# Altium project MB1455.PrjPcb
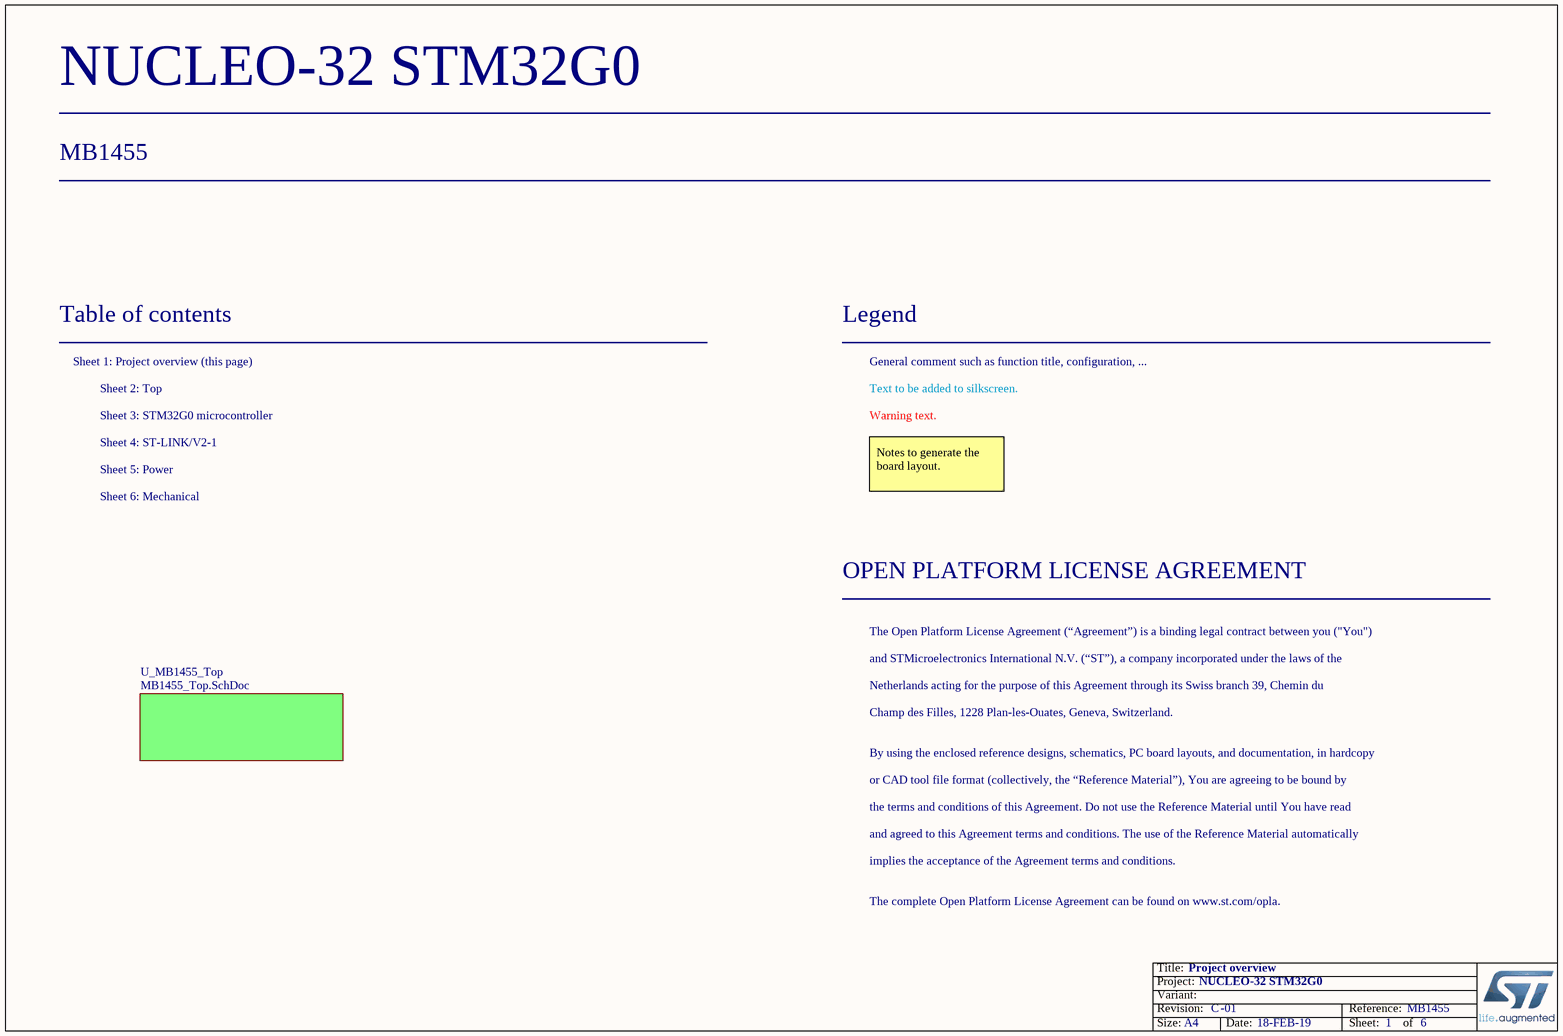
[diagram p0: Project_overview.SchDoc]
Board_Assembly_Revision: 01; Board_Document_Date: 18-FEB-19; Board_Name: NUCLEO-32 STM32G0; Board_PCB_Revision: C; Board_Reference: MB1455
6 sheets, 97 parts. Net scope: flat (ports and power ports of the same name join across sheets).
Board file: MB1455.PcbDoc
Sheets:
  Project_overview.SchDoc
    U_MB1455_Top = MB1455_Top.SchDoc
      U_Power = Power.SchDoc
      Mechanical = Mechanical.SchDoc
      U_ST_LINK_V2-1 = ST_LINK_V2-1.SCHDOC
      U_STM32G0_microcontroller = STM32G0_microcontroller.SchDoc

## Sheet Project_overview.SchDoc: Project overview
size A4; Date: Not used; ApprovedBy: Not used; CheckedBy: Not used; Author: Not used; CompanyName: STMicroelectronics; DrawnBy: Not used; Engineer: Not used; Organization: Not used; Address1: Not used; Address2: Not used; Address3: Not used; Address4: Not used; DocumentNumber: Not used; Revision: Not used; SheetNumber: 1; SheetTotal: 6; CurrentTime: Not used; CurrentDate: Not used; Time: Not used; DocumentFullPathAndName: Not used; DocumentName: Not used; ModifiedDate: Not used; ImagePath: Not used; ProjectName: Not used; Application_BuildNumber: Not used

### Sub-sheets
U_MB1455_Top = MB1455_Top.SchDoc: no entries

### Notes on the sheet
- Table of contents
- Sheet 1: Project overview (this page)
- Legend
- General comment such as function title, configuration, ...
- Sheet 2: Top
- Sheet 4: ST-LINK/V2-1
- Sheet 3: STM32G0 microcontroller
- Text to be added to silkscreen.
- Warning text.
- Sheet 5: Power
- Sheet 6: Mechanical
- Notes to generate the board layout.
- OPEN PLATFORM LICENSE AGREEMENT
- The Open Platform License Agreement (“Agreement”) is a binding legal contract between you ("You")
- and STMicroelectronics International N.V. (“ST”), a company incorporated under the laws of the
- Netherlands acting for the purpose of this Agreement through its Swiss branch 39, Chemin du
- Champ des Filles, 1228 Plan-les-Ouates, Geneva, Switzerland.
- By using the enclosed reference designs, schematics, PC board layouts, and documentation, in hardcopy
- or CAD tool file format (collectively, the “Reference Material”), You are agreeing to be bound by
- the terms and conditions of this Agreement. Do not use the Reference Material until You have read
- and agreed to this Agreement terms and conditions. The use of the Reference Material automatically
- implies the acceptance of the Agreement terms and conditions.
- The complete Open Platform License Agreement can be found on www.st.com/opla.
- Title:
- Project:
- Size:
- Revision:
- Variant:
- A4
- -
- Date:
- Reference:
- Sheet:
- of

## Sheet MB1455_Top.SchDoc: Top hierarchical view
size A4; Date: Not used; ApprovedBy: Not used; CheckedBy: Not used; Author: Not used; CompanyName: STMicroelectronics; DrawnBy: Not used; Engineer: Not used; Organization: Not used; Address1: Not used; Address2: Not used; Address3: Not used; Address4: Not used; DocumentNumber: Not used; Revision: A-01-P3; SheetNumber: 2; SheetTotal: 6; CurrentTime: Not used; CurrentDate: Not used; Time: Not used; DocumentFullPathAndName: Not used; DocumentName: Not used; ModifiedDate: Not used; ImagePath: Not used; ProjectName: Not used; Application_BuildNumber: Not used
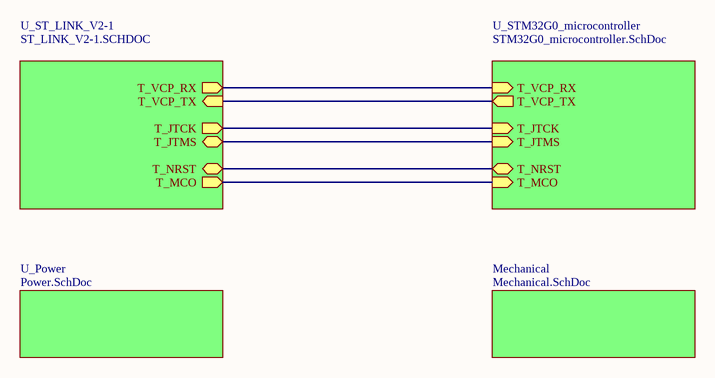
[diagram p1: MB1455_Top.SchDoc]

### Sub-sheets
Mechanical = Mechanical.SchDoc: no entries
U_Power = Power.SchDoc: no entries
U_ST_LINK_V2-1 = ST_LINK_V2-1.SCHDOC: T_VCP_RX (out), T_VCP_TX (in), T_JTMS (bidir), T_JTCK (out), T_NRST (bidir), T_MCO (out)
U_STM32G0_microcontroller = STM32G0_microcontroller.SchDoc: T_NRST (bidir), T_JTCK (in), T_JTMS (in), T_VCP_RX (in), T_VCP_TX (out), T_MCO (in)

### Nets
(unnamed): sheet U_ST_LINK_V2-1/T_VCP_RX, sheet U_STM32G0_microcontroller/T_VCP_RX
(unnamed): sheet U_ST_LINK_V2-1/T_VCP_TX, sheet U_STM32G0_microcontroller/T_VCP_TX
(unnamed): sheet U_ST_LINK_V2-1/T_JTMS, sheet U_STM32G0_microcontroller/T_JTMS
(unnamed): sheet U_ST_LINK_V2-1/T_JTCK, sheet U_STM32G0_microcontroller/T_JTCK
(unnamed): sheet U_ST_LINK_V2-1/T_NRST, sheet U_STM32G0_microcontroller/T_NRST
(unnamed): sheet U_ST_LINK_V2-1/T_MCO, sheet U_STM32G0_microcontroller/T_MCO

### Notes on the sheet
- Title:
- Project:
- Size:
- Revision:
- Variant:
- A4
- -
- Date:
- Reference:
- Sheet:
- of

## Sheet Power.SchDoc: Power
size A4; Date: Not used; ApprovedBy: Not used; CheckedBy: Not used; Author: Not used; CompanyName: STMicroelectronics; DrawnBy: Not used; Engineer: Not used; Organization: Not used; Address1: Not used; Address2: Not used; Address3: Not used; Address4: Not used; DocumentNumber: Not used; Revision: Not used; SheetNumber: 5; SheetTotal: 6; CurrentTime: Not used; CurrentDate: Not used; Time: Not used; DocumentFullPathAndName: Not used; DocumentName: Not used; ModifiedDate: Not used; ImagePath: Not used; ProjectName: Not used; Application_BuildNumber: Not used
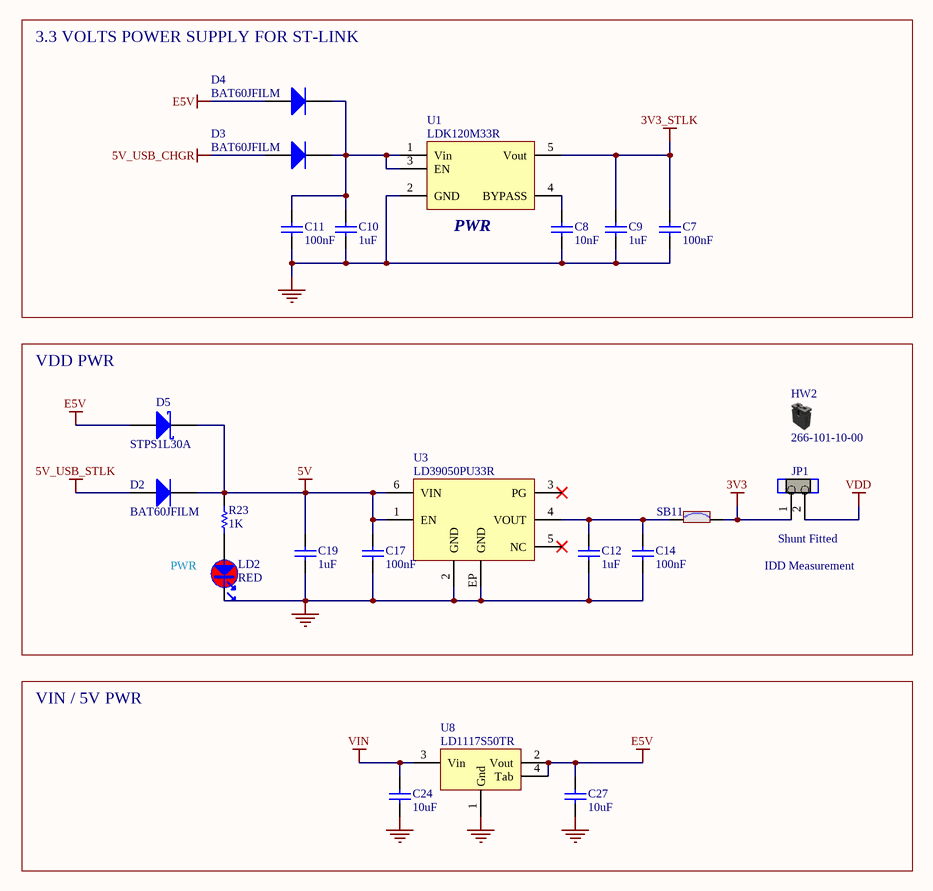
[diagram p2: Power.SchDoc]

### Parts
C7  value 100nF  [C0402]  (hidden comment: Capacitor)
C8  value 10nF  [C0402]  (hidden comment: Capacitor)
C9  value 1uF  [C0402]  (hidden comment: Capacitor)
C10  value 1uF  [C0402]  (hidden comment: Capacitor)
C11  value 100nF  [C0402]  (hidden comment: Capacitor)
C12  value 1uF  [C0402]  (hidden comment: Capacitor)
C14  value 100nF  [C0402]  (hidden comment: Capacitor)
C17  value 100nF  [C0402]  (hidden comment: Capacitor)
C19  value 1uF  [C0402]  (hidden comment: Capacitor)
C24  value 10uF  [C0805]  (hidden comment: Capacitor)
C27  value 10uF  [C0805]  (hidden comment: Capacitor)
D2  BAT60JFILM  [DIO_SOD323]
D3  BAT60JFILM  [DIO_SOD323]
D4  BAT60JFILM  [DIO_SOD323]
D5  value STPS1L30A  [DIO_SMA_1A_2K]  (hidden comment: STPS1L40M)
HW2  value 266-101-10-00  (hidden comment: Shunt Black 1.27mm 266-101-10-00)  (mechanical)
JP1  value Shunt Fitted  [CON_WP_707-2-02-2-20-00]  (hidden comment: Jumper_Header1.27 2x1 Fitted)
LD2  value RED  [LED_0603_RED_H0P4]  (hidden comment: LED_red)
R23  value 1K  [R0402]  (hidden comment: Resistor)
SB11  SB_ON  [SOLDER-BRIDGE_R0603-0R]  (value not drawn)
U1  LDK120M33R  [REG_SOT23-5L]
U3  LD39050PU33R  [ICC_DFN6-EPAD_3X3_P095]
U8  LD1117S50TR  [REG_SOT223-TAB]

### Blocks framed on the sheet
VDD PWR: C12 C14 C17 C19 D2 D5 HW2 JP1 LD2 R23 SB11 U3
VIN / 5V PWR: C24 C27 U8

### Nets
3V3: JP1.1 SB11.2
3V3_STLK: C7.2 C9.2 U1.5(Vout)
5V: C17.2 C19.2 D2.2(K) D5.2(K) R23.2 U3.1(EN) U3.6(VIN)
5V_USB_CHGR: D3.1(A)
5V_USB_STLK: D2.1(A)
E5V: C27.2 D4.1(A) D5.1(A) U8.2(Vout) U8.4(Tab)
GND: C7.1 C8.1 C9.1 C10.1 C11.1 C12.1 C14.1 C17.1 C19.1 C24.1 C27.1 LD2.2 U1.2(GND) U3.2(GND) U3.EP(GND) U8.1(Gnd)
VDD: JP1.2
VIN: C24.2 U8.3(Vin)
NetC8_2: C8.2 U1.4(BYPASS)
NetC10_2: C10.2 C11.2 D3.2(K) D4.2(K) U1.1(Vin) U1.3(EN)
NetC12_2: C12.2 C14.2 SB11.1 U3.4(VOUT)
NetLD2_1: LD2.1 R23.1

Not connected (* = marked no-connect by the designer): U3 3(PG)* 5(NC)*

### Notes on the sheet
- 3.3 VOLTS POWER SUPPLY FOR ST-LINK
- (near U1) PWR
- PWR
- IDD Measurement
- Title:
- Project:
- Size:
- Revision:
- Variant:
- A4
- -
- Date:
- Reference:
- Sheet:
- of

### Library data of the parts
C7 C11 C14 C17 = MCD-00102: Capacitor, MLCC, 100nF, 16V, X7R, 10%, 0402, T=0,5mm; Manufacturer_Part_Number: CC0402KRX7R7BB104; Manufacturer: YAGEO; Alternate_Manufacturer_Part_Number: GCM155R71C104KA55D; Alternate_Manufacturer: MURATA; Provided_By: SUBCO; ECCN_US: EAR99; ECCN_EU: NEC; Internal_Part_Number: MCD-00102; Status: Released; Package: C0402; ComponentLink1Description: Datasheet; Part_Type: Capacitor; ComponentLink1URL: http://tunmcdsvn.tun.st.com/Component_Datasheet_Library/Trunk/Capacitors/Yageo_Multilayer_Capacitor_X7R_series_100pF_to_22uF
C8 = MCD-00011: Capacitor, MLCC, 10nF, 16V, X7R, 10%, 0402, T=0.5mm; Manufacturer_Part_Number: CC0402KRX7R7BB103; Manufacturer: YAGEO; Provided_By: SUBCO; ECCN_US: EAR99; ECCN_EU: NEC; Internal_Part_Number: MCD-00011; Status: Released; Part_Type: Capacitor; Package: C0402; ComponentLink1Description: Datasheet; ComponentLink1URL: http://tunmcdsvn.tun.st.com/Component_Datasheet_Library/Trunk/Capacitors/Yageo_Multilayer_Capacitor_X7R_series_100pF_to_22uF
C9 C10 C12 C19 = MCD-00095: Capacitor, MLCC, 1uF, 6V3, X5R, 10%, 0402, T=0,5mm; Manufacturer_Part_Number: GRM155R61E105KA12; Manufacturer: MURATA; Alternate_Manufacturer_Part_Number: GRM155R60J105KE19; Provided_By: SUBCO; ECCN_US: EAR99; ECCN_EU: NEC; Internal_Part_Number: MCD-00095; Status: Released; Package: C0402; ComponentLink1Description: Datasheet; Part_Type: Capacitor; ComponentLink1URL: http://tunmcdsvn.tun.st.com/Component_Datasheet_Library/Trunk/Capacitors/Murata_Capacitor_GR_series; Alternate_Manufacturer: MURATA
C24 C27 = MCD-00014: Capacitor, MLCC, 10uF, 25V, X5R, 10%, 0805, T=0,85mm; Manufacturer_Part_Number: CC0805KRX5R8BB106; Manufacturer: YAGEO; Provided_By: SUBCO; ECCN_US: EAR99; ECCN_EU: NEC; Internal_Part_Number: MCD-00014; ComponentLink1Description: Datasheet; Status: Released; Part_Type: Capacitor; Package: C0805; ComponentLink1URL: http://tunmcdsvn.tun.st.com/Component_Datasheet_Library/Trunk/Capacitors/Yageo_Multilayer_capacitor_X5R_series_100pF_to_100uF
D2-D4 = MCD-00034: Part_Type: Diode; Manufacturer: STMICROELECTRONICS; BMS_Part_Number: 9151097; ECCN_US: EAR99; ECCN_EU: NEC; Provided_By: SUBCO with ST control; Internal_Part_Number: MCD-00034; Value: BAT60JFILM; Status: Released; Manufacturer_Part_Number: BAT60JFILM; ComponentLink1Description: Datasheet; ComponentLink1URL: http://tunmcdsvn.tun.st.com/Component_Datasheet_Library/Trunk/Diodes/STM_Diode_BAT60JFILM-SOD323
D5 = MCD-01059: LOW DROP POWER SCHOTTKY RECTIFIER 1A 30V VF=0.3V; Part_Type: Diode; Manufacturer: STMICROELECTRONICS; BMS_Part_Number: 9151096; Provided_By: SUBCO with ST control; ECCN_US: EAR99; ECCN_EU: NEC; Internal_Part_Number: MCD-01059; Status: Footprint available; Manufacturer_Part_Number: STPS1L30A; Package: DIO_SMA_1A_2K; ComponentLink1Description: Datasheet; ComponentLink1URL: http://tunmcdsvn.tun.st.com/Component_Datasheet_Library/Trunk/Diodes/STM_SCHOTTKY_STPS1L30
HW2 = MCD-01409: SHUNT 1.27mm BLACK; Part_Type: Mechanical; Manufacturer: W & P Products; Alternate_Manufacturer_Part_Number: M50-1900005; Alternate_Manufacturer: HARWIN; Provided_By: SUBCO; Internal_Part_Number: MCD-01409; Status: Checked; Manufacturer_Part_Number: 266-101-10-00; ComponentLink1Description: Datasheet; ComponentLink1URL: http://tunmcdsvn.tun.st.com/Component_Datasheet_Library/Trunk/Connectors/WPPRO_Shunt_Jumper_266; ECCN_US: n/a; ECCN_EU: n/a
JP1 = MCD-01428: Header, 2x1, 1,27mm, Right Angled, Single Row, Height 3.05mm/1.27mm; Part_Type: Connector; Manufacturer_Part_Number: 707-2-02-2-20-00; Manufacturer: W & P Products; Provided_By: SUBCO; Internal_Part_Number: MCD-01428; Status: Checked; ComponentLink1Description: Datasheet; ComponentLink1URL: http://tunmcdsvn.tun.st.com/Component_Datasheet_Library/Trunk/Connectors/WPPRO_connector_707-series; ECCN_US: n/a; ECCN_EU: n/a
LD2 = MCD-00322: LED, Red, 0603; Manufacturer_Part_Number: 19-217/R6C-AL1M2VY/3T; Manufacturer: EVERLIGHT; Part_Type: Display; Provided_By: SUBCO; ECCN_US: EAR99; ECCN_EU: NEC; Internal_Part_Number: MCD-00322; ComponentLink1Description: Datasheet; Status: Released; ComponentLink1URL: http://tunmcdsvn.tun.st.com/Component_Datasheet_Library/Trunk/Display/Everlight_SMD-LED-RED_19-213-R6C-AP1Q2B-3T-V3.doc; Package: LED 0603
R23 = MCD-00061: Resistor,1K,0402,1%,1/16W; Manufacturer_Part_Number: RC0402FR-071KL; Manufacturer: YAGEO; Provided_By: SUBCO; ECCN_US: EAR99; ECCN_EU: NEC; Internal_Part_Number: MCD-00061; Status: Released; Part_Type: Resistor; Package: R0402; ComponentLink1Description: Datasheet; ComponentLink1URL: http://tunmcdsvn.tun.st.com/Component_Datasheet_Library/Trunk/Resistors/Yageo_Resistor_RC0402-series
SB11 = MCD-00071: Solder Bridge ON; Part_Type: Mechanical; Manufacturer_Part_Number: RC0603JR-070RL; Manufacturer: YAGEO; Provided_By: SUBCO; Internal_Part_Number: MCD-00071; ECCN_US: n/a; ECCN_EU: n/a; Status: Released; Package: SB0603; ComponentLink1Description: Datasheet; ComponentLink1URL: http://tunmcdsvn.tun.st.com/Component_Datasheet_Library/Trunk/Resistors/Yageo_Resistor_RC0603-series
U1 = MCD-00663: 200 mA low quiescent current very low noise LDO; Part_Type: IC; Manufacturer: STMICROELECTRONICS; BMS_Part_Number: 9176330; ECCN_US: EAR99; ECCN_EU: NEC; Provided_By: SUBCO with ST control; Internal_Part_Number: MCD-00663; Value: LDK120M33R; Status: Footprint available; Manufacturer_Part_Number: LDK120M33R; Package: SOT23-5L; ComponentLink1Description: Datasheet; ComponentLink1URL: http://tunmcdsvn.tun.st.com/Component_Datasheet_Library/Trunk/IC/STM_LDO_LDK120M33R
U3 = MCD-00215: Low quiescent current and low noise voltage regulators; Manufacturer: STMICROELECTRONICS; Part_Type: IC; BMS_Part_Number: 9176126; Provided_By: SUBCO with ST control; ECCN_US: EAR99; ECCN_EU: NEC; Value: LD39050PU33R; Internal_Part_Number: MCD-00215; Manufacturer_Part_Number: LD39050PU33R; Status: Released; ComponentLink1Description: Datasheet; ComponentLink1URL: http://tunmcdsvn.tun.st.com/Component_Datasheet_Library/Trunk/IC/STM_LDO_LD39050PU; Package: DFN6 3x3mm
U8 = MCD-00088: IC REG LDO 5V 0.8A SOT223; Manufacturer: STMICROELECTRONICS; BMS_Part_Number: 9176133; Provided_By: SUBCO with ST control; ECCN_US: EAR99; ECCN_EU: NEC; Value: LD1117S50TR; Internal_Part_Number: MCD-00088; Manufacturer_Part_Number: LD1117S50TR; ComponentLink1Description: Datasheet; Status: Released; Part_Type: IC; ComponentLink1URL: http://tunmcdsvn.tun.st.com/Component_Datasheet_Library/Trunk/IC/STM_LDO_LD1117; Package: SOT-223

## Sheet Mechanical.SchDoc: Mechanical
size A4; Date: Not used; ApprovedBy: Not used; CheckedBy: Not used; Author: Not used; CompanyName: STMicroelectronics; DrawnBy: Not used; Engineer: Not used; Organization: Not used; Address1: Not used; Address2: Not used; Address3: Not used; Address4: Not used; DocumentNumber: Not used; Revision: Not used; SheetNumber: 6; SheetTotal: 6; CurrentTime: Not used; CurrentDate: Not used; Time: Not used; DocumentFullPathAndName: Not used; DocumentName: Not used; ModifiedDate: Not used; ImagePath: Not used; ProjectName: Not used; Application_BuildNumber: Not used
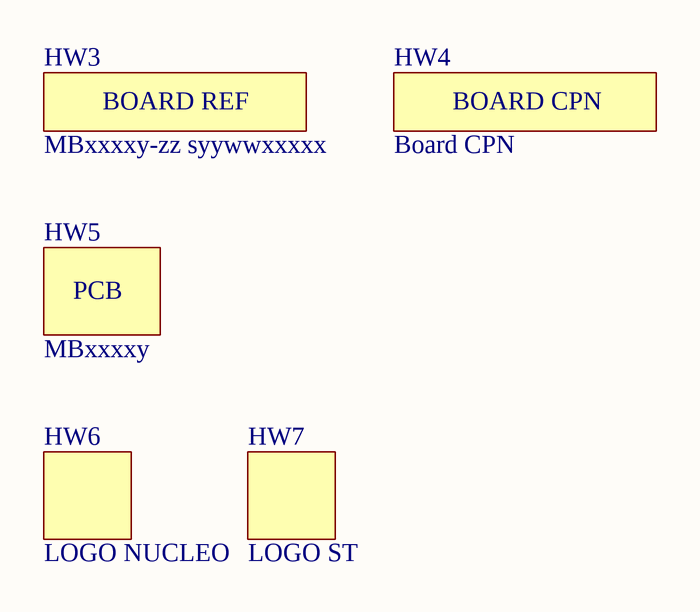
[diagram p3: Mechanical.SchDoc]

### Parts
HW3  value MBxxxxy-zz syywwxxxxx  [STICKER_25X9]  (hidden comment: STICKER_BOARD_REF)  (mechanical)
HW4  value Board CPN  [STICKER_25X9]  (hidden comment: STICKER_BOARD_CPN)  (mechanical)
HW5  value MBxxxxy  (hidden comment: PCB)  (mechanical)
HW6  value LOGO NUCLEO  [LOGO_NUCLEO]  (hidden comment: Logo)  (no BOM)
HW7  value LOGO ST  [LOGO_ST]  (hidden comment: Logo)  (no BOM)

### Notes on the sheet
- Title:
- Project:
- Size:
- Revision:
- Variant:
- A4
- -
- Date:
- Reference:
- Sheet:
- of
- (in symbol MCD-00235) BOARD REF
- (in symbol MCD-00547) BOARD CPN

### Library data of the parts
HW3 = MCD-00235: Sticker to mention board reference + serial number; Part_Type: Mechanical; Provided_By: SUBCO; Internal_Part_Number: MCD-00235; Status: Released; Manufacturer_Part_Number: n/a; Manufacturer: n/a; ComponentLink1Description: Datasheet; ComponentLink1URL: n/a; ECCN_US: n/a; ECCN_EU: n/a
HW4 = MCD-00547: Sticker to mention board CPN code; Part_Type: Mechanical; Provided_By: SUBCO; Internal_Part_Number: MCD-00547; Status: Released; Manufacturer_Part_Number: n/a; Manufacturer: n/a; ComponentLink1Description: Datasheet; ComponentLink1URL: NA; ECCN_US: n/a; ECCN_EU: n/a
HW5 = MCD-00216: PCB, xxxx for PCB number, Y for PCB revision; Part_Type: Mechanical; Provided_By: SUBCO; Internal_Part_Number: MCD-00216; Status: Released; ComponentLink1Description: Datasheet; Manufacturer_Part_Number: n/a; Manufacturer: n/a; ECCN_US: n/a; ECCN_EU: n/a
HW6 = MCD-00636: NUCLEO logo footprint for PCB; Part_Type: Mechanical; Internal_Part_Number: MCD-00636; Status: Released; Provided_By: n/a; ComponentLink1Description: Datasheet; ECCN_US: n/a; ECCN_EU: n/a
HW7 = MCD-00625: STMicroelectronics logo footprint for PCB; Part_Type: Mechanical; Internal_Part_Number: MCD-00625; Status: Released; Provided_By: n/a; Manufacturer_Part_Number: n/a; Manufacturer: n/a; ComponentLink1Description: Datasheet; ComponentLink1URL: http://na; ECCN_US: n/a; ECCN_EU: n/a

## Sheet ST_LINK_V2-1.SCHDOC: ST_LINK_V2-1
size A4; Date: Not used; ApprovedBy: Not used; CheckedBy: Not used; Author: Not used; CompanyName: STMicroelectronics; DrawnBy: Not used; Engineer: Not used; Organization: Not used; Address1: Not used; Address2: Not used; Address3: Not used; Address4: Not used; DocumentNumber: Not used; Revision: Not used; SheetNumber: 4; SheetTotal: 6; CurrentTime: Not used; CurrentDate: Not used; Time: Not used; DocumentFullPathAndName: Not used; DocumentName: Not used; ModifiedDate: Not used; ImagePath: Not used; ProjectName: Not used; Application_BuildNumber: Not used
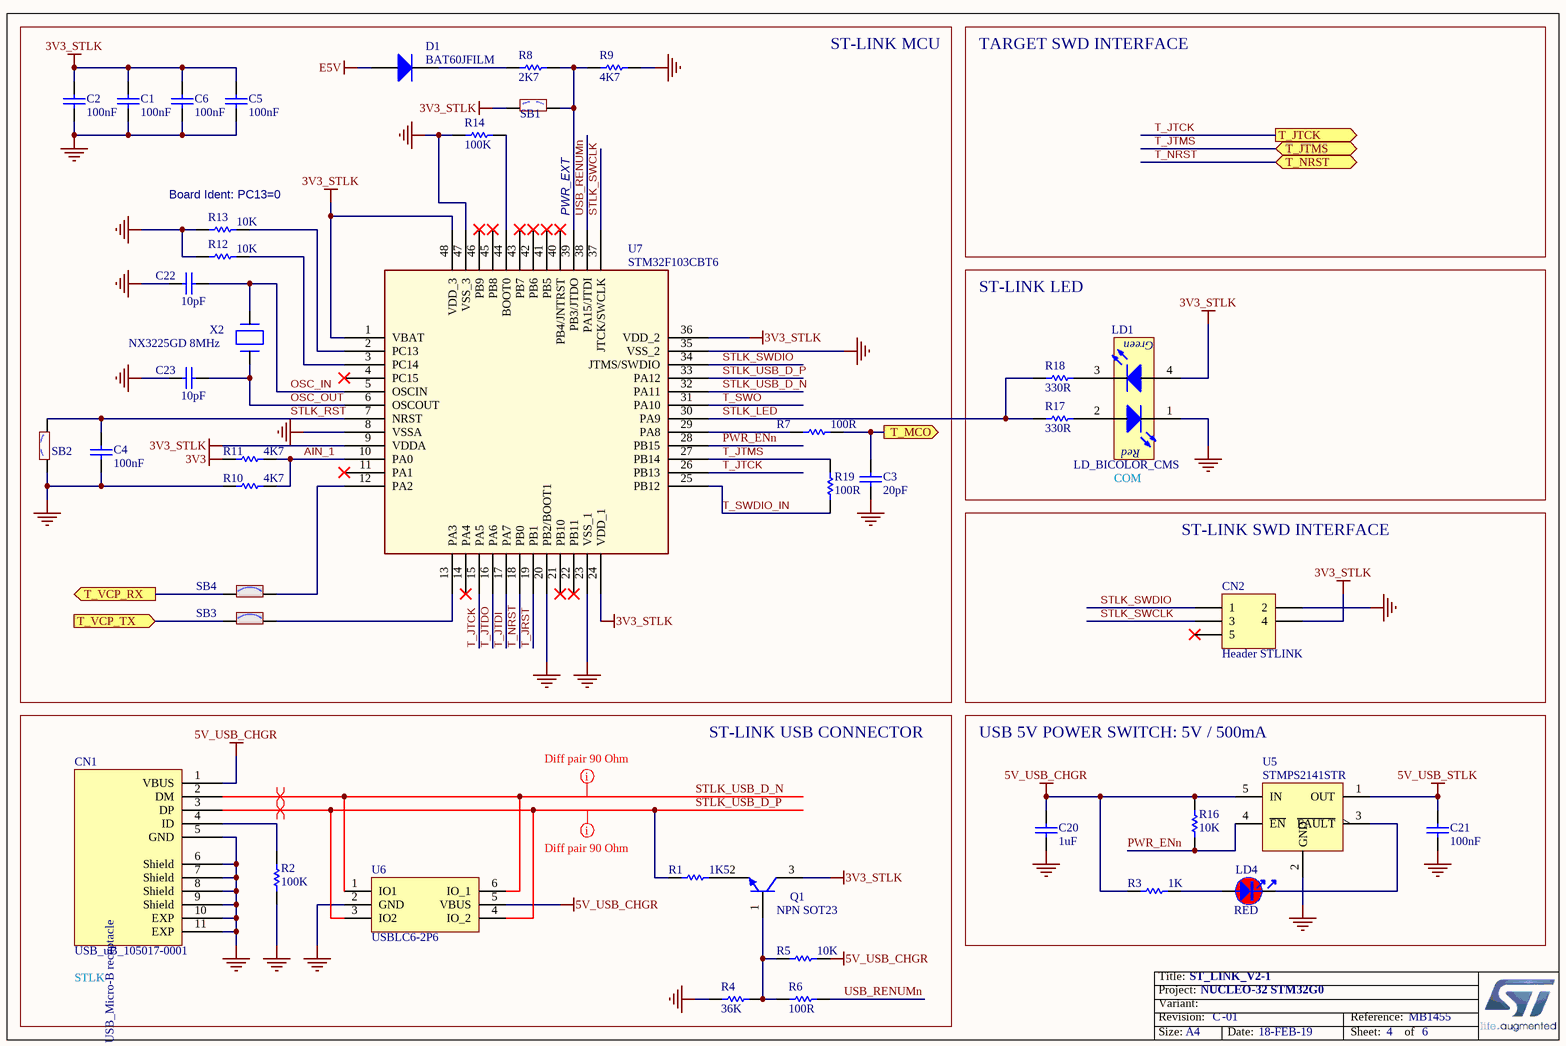
[diagram p4: ST_LINK_V2-1.SCHDOC]

### Parts
C1  value 100nF  [C0402]  (hidden comment: Capacitor)
C2  value 100nF  [C0402]  (hidden comment: Capacitor)
C3  value 20pF  [C0402]  (hidden comment: Capacitor)
C4  value 100nF  [C0402]  (hidden comment: Capacitor)
C5  value 100nF  [C0402]  (hidden comment: Capacitor)
C6  value 100nF  [C0402]  (hidden comment: Capacitor)
C20  value 1uF  [C0402]  (hidden comment: Capacitor)
C21  value 100nF  [C0402]  (hidden comment: Capacitor)
C22  value 10pF  [C0402]  (hidden comment: Capacitor)
C23  value 10pF  [C0402]  (hidden comment: Capacitor)
CN1  value USB_uB_105017-0001  [CON_USBMICROB_MOLEX_105017-0001_H2P90]  (hidden comment: USB_uB_105017.0001)
CN2  Header STLINK  [HDR_1x5_2R54_V_M]
D1  BAT60JFILM  [DIO_SOD323]
LD1  LD_BICOLOR_CMS  [LED_BI-GR_HSMF-A201-A00J1]
LD4  value RED  [LED_0603_RED_H0P4]  (hidden comment: LED_red)
Q1  value NPN SOT23  [NPN_SOT23]  (hidden comment: 9013-SOT23)
R1  value 1K5  [R0402]  (hidden comment: Resistor)
R2  value 100K  [R0402]  (hidden comment: Resistor)
R3  value 1K  [R0402]  (hidden comment: Resistor)
R4  value 36K  [R0402]  (hidden comment: Resistor)
R5  value 10K  [R0402]  (hidden comment: Resistor)
R6  value 100R  [R0402]  (hidden comment: Resistor)
R7  value 100R  [R0402]  (hidden comment: Resistor)
R8  value 2K7  [R0402]  (hidden comment: Resistor)
R9  value 4K7  [R0402]  (hidden comment: Resistor)
R10  value 4K7  [R0402]  (hidden comment: Resistor)
R11  value 4K7  [R0402]  (hidden comment: Resistor)
R12  value 10K  [R0402]  (hidden comment: Resistor)
R13  value 10K  [R0402]  (hidden comment: Resistor)
R14  value 100K  [R0402]  (hidden comment: Resistor)
R16  value 10K  [R0402]  (hidden comment: Resistor)
R17  value 330R  [R0402]  (hidden comment: Resistor)
R18  value 330R  [R0402]  (hidden comment: Resistor)
R19  value 100R  [R0402]  (hidden comment: Resistor)
SB1  SB_OFF  [SOLDER-BRIDGE_R0603-0R]  (value not drawn)
SB2  SB_OFF  [SOLDER-BRIDGE_R0603-0R]  (value not drawn)
SB3  SB_ON  [SOLDER-BRIDGE_R0603-0R]  (value not drawn)
SB4  SB_ON  [SOLDER-BRIDGE_R0603-0R]  (value not drawn)
U5  STMPS2141STR  [MOS_SOT23-5L]
U6  USBLC6-2P6  [ESD_SOT666]
U7  STM32F103CBT6  [ICC_LQFP48_7X7_P050]
X2  value NX3225GD 8MHz  [CRY_NX3225GD_2P]  (hidden comment: XTAL_2_PINS)

### Blocks framed on the sheet
ST-LINK MCU: C1-C6 C22 C23 D1 R7-R14 R19 SB1-SB4 U7 X2
ST-LINK LED: LD1 R17 R18
ST-LINK SWD INTERFACE: CN2
ST-LINK USB CONNECTOR: CN1 Q1 R1 R2 R4-R6 U6
USB 5V POWER SWITCH: 5V / 500mA: C20 C21 LD4 R3 R16 U5

### Ports
T_JTCK (out), T_JTMS (bidir), T_MCO (out), T_NRST (bidir), T_VCP_RX (out), T_VCP_TX (in)

### Nets
3V3: R11.1
3V3_STLK: C1.2 C2.2 C5.2 C6.2 CN2.4 LD1.4(YellowGreen_anode) Q1.3(C) SB1.1 U7.1(VBAT) U7.9(VDDA) U7.24(VDD_1) U7.36(VDD_2) U7.48(VDD_3)
5V_USB_CHGR: C20.2 CN1.1(VBUS) R3.1 R5.2 R16.2 U5.5(IN) U6.5(VBUS)
5V_USB_STLK: C21.2 U5.1(OUT)
E5V: D1.1(A)
GND: C1.1 C2.1 C3.1 C4.1 C5.1 C6.1 C20.1 C21.1 C22.1 C23.1 CN1.5(GND) CN1.6(Shield) CN1.7(Shield) CN1.8(Shield) CN1.9(Shield) CN1.10(EXP) CN1.11(EXP) CN2.2 LD1.1(RED_cathode) R2.1 R4.1 R9.2 R10.1 R12.1 R13.1 R14.1 SB2.1 U5.2(GND) U6.2(GND) U7.8(VSSA) U7.20(PB2/BOOT1) U7.23(VSS_1) U7.35(VSS_2) U7.47(VSS_3)
AIN_1: R10.2 R11.2 U7.10(PA0)
OSC_IN: C22.2 U7.5(OSCIN) X2.1(X1)
OSC_OUT: C23.2 U7.6(OSCOUT) X2.2(X2)
PWR_ENn: R16.1 U5.4(~{EN}) U7.28(PB15)
STLK_LED: R17.1 R18.1 U7.30(PA9)
STLK_RST: C4.2 SB2.2 U7.7(NRST)
STLK_SWCLK: CN2.3 U7.37(JTCK/SWCLK)
STLK_SWDIO: CN2.1 U7.34(JTMS/SWDIO)
STLK_USB_D_N: CN1.2(DM) U6.1(IO1) U6.6(IO_1) U7.32(PA11)
STLK_USB_D_P: CN1.3(DP) R1.1 U6.3(IO2) U6.4(IO_2) U7.33(PA12)
T_JRST: U7.19(PB1)
T_JTCK: U7.15(PA5) U7.26(PB13) ; port T_JTCK
T_JTDI: U7.17(PA7)
T_JTDO: U7.16(PA6)
T_JTMS: R19.2 U7.27(PB14) ; port T_JTMS
T_NRST: U7.18(PB0) ; port T_NRST
T_SWDIO_IN: R19.1 U7.25(PB12)
T_SWO: U7.31(PA10)
USB_RENUMn: R6.2 U7.38(PA15/JTDI)
NetC3_2: C3.2 R7.2 ; port T_MCO
NetCN1_4: CN1.4(ID) R2.2
NetD1_2: D1.2(K) R8.1
NetLD1_2: LD1.2(Red_anode) R17.2
NetLD1_3: LD1.3(YellowGreen_cathode) R18.2
NetLD4_1: LD4.1 R3.2
NetLD4_2: LD4.2 U5.3(~{FAULT})
NetQ1_1: Q1.1(B) R4.2 R5.1 R6.1
NetQ1_2: Q1.2(E) R1.2
NetR7_1: R7.1 U7.29(PA8)
NetR8_2: R8.2 R9.1 SB1.2 U7.39(PB3/JTDO)
NetR12_2: R12.2 U7.3(PC14)
NetR13_2: R13.2 U7.2(PC13)
NetR14_2: R14.2 U7.44(BOOT0)
NetSB3_1: SB3.1 ; port T_VCP_TX
NetSB3_2: SB3.2 U7.13(PA3)
NetSB4_1: SB4.1 ; port T_VCP_RX
NetSB4_2: SB4.2 U7.12(PA2)

Not connected (* = marked no-connect by the designer): CN2 5*; U7 4(PC15)* 11(PA1)* 14(PA4)* 21(PB10)* 22(PB11)* 40(PB4/JNTRST)* 41(PB5)* 42(PB6)* 43(PB7)* 45(PB8)* 46(PB9)*

### Layout directives
differential pair: STLK_USB_D_N, STLK_USB_D_P
mark named Diff pair 90 Ohm: STLK_USB_D_N, STLK_USB_D_P

### Notes on the sheet
- TARGET SWD INTERFACE
- (near R13) Board Ident: PC13=0
- PWR_EXT
- COM
- STLK
- Title:
- Project:
- Size:
- Revision:
- Variant:
- A4
- -
- Date:
- Reference:
- Sheet:
- of
- (in symbol MCD-00028) USB_Micro-B receptacle
- (in symbol MCD-00051) Green; Red

### Library data of the parts
C1 C2 C4-C6 C21 = MCD-00102: as C7 on sheet Power; Internal_Part_Number: MCD-00102; Status: Released; Package: C0402; ComponentLink1Description: Datasheet; Part_Type: Capacitor; ComponentLink1URL: http://tunmcdsvn.tun.st.com/Component_Datasheet_Library/Trunk/Capacitors/Yageo_Multilayer_Capacitor_X7R_series_100pF_to_22uF
C3 = MCD-00016: Capacitor, MLCC, 20pF, 50V, NPO, 5%, 0402, T=0,5mm; Manufacturer_Part_Number: CC0402JRNPO9BN200; Manufacturer: YAGEO; Provided_By: SUBCO; ECCN_US: EAR99; ECCN_EU: NEC; Internal_Part_Number: MCD-00016; Status: Released; Part_Type: Capacitor; Package: C0402; ComponentLink1Description: Datasheet; ComponentLink1URL: http://tunmcdsvn.tun.st.com/Component_Datasheet_Library/Trunk/Capacitors/Yageo_Capacitor_NP0_16V-to-50V
C20 = MCD-00095: as C9 on sheet Power; Internal_Part_Number: MCD-00095; Status: Released; Package: C0402; ComponentLink1Description: Datasheet; Part_Type: Capacitor; ComponentLink1URL: http://tunmcdsvn.tun.st.com/Component_Datasheet_Library/Trunk/Capacitors/Murata_Capacitor_GR_series; Alternate_Manufacturer: MURATA
C22 C23 = MCD-00015: Capacitor, MLCC, 10pF, 50V, NPO, 5%, 0402, T=0,5mm; Manufacturer_Part_Number: CC0402JRNPO9BN100; Manufacturer: YAGEO; Provided_By: SUBCO; ECCN_US: EAR99; ECCN_EU: NEC; Internal_Part_Number: MCD-00015; Status: Released; Part_Type: Capacitor; Package: C0402; ComponentLink1Description: Datasheet; ComponentLink1URL: http://tunmcdsvn.tun.st.com/Component_Datasheet_Library/Trunk/Capacitors/Yageo_Capacitor_NP0_16V-to-50V
CN1 = MCD-00028: USB-MICRO-B, 0.65mm, RA, SMT, Bottom Mount,; Part_Type: Connector; Manufacturer_Part_Number: 1050170001; Manufacturer: MOLEX; Provided_By: SUBCO; Internal_Part_Number: MCD-00028; Status: Released; ComponentLink1Description: Datasheet; ComponentLink1URL: http://tunmcdsvn.tun.st.com/Component_Datasheet_Library/Trunk/Connectors/Molex_Connector-USB-microB_105017-0001; ECCN_US: n/a; ECCN_EU: n/a
CN2 = MCD-01399: Header 5 pads for ST-LINK prog. Not fitted; Part_Type: Mechanical; Provided_By: SUBCO; Internal_Part_Number: MCD-01399; Value: Header STLINK; Status: Footprint available; Manufacturer_Part_Number: n/a; Manufacturer: n/a; ComponentLink1Description: Datasheet; ECCN_US: n/a; ECCN_EU: n/a
D1 = MCD-00034: Manufacturer: STMICROELECTRONICS; Part_Type: Diode; BMS_Part_Number: 9151097; ECCN_US: EAR99; ECCN_EU: NEC; Provided_By: SUBCO with ST control; Internal_Part_Number: MCD-00034; Value: BAT60JFILM; Manufacturer_Part_Number: BAT60JFILM; ComponentLink1Description: Datasheet; Status: Released; ComponentLink1URL: http://tunmcdsvn.tun.st.com/Component_Datasheet_Library/Trunk/Diodes/STM_Diode_BAT60JFILM-SOD323
LD1 = MCD-00051: LED Bicolor; Part_Type: Display; Manufacturer_Part_Number: HSMF-A201-A00J1; Manufacturer: AVAGO TECHNOLOGIES; Alternate_Manufacturer_Part_Number: LE-RGW35280; Alternate_Manufacturer: EVERLUCK; ECCN_US: EAR99; ECCN_EU: NEC; Provided_By: SUBCO; Internal_Part_Number: MCD-00051; Value: LD_BICOLOR_CMS; Status: Released; ComponentLink1Description: Datasheet; ComponentLink1URL: http://tunmcdsvn.tun.st.com/Component_Datasheet_Library/Trunk/Display/Avago_LED-SMC_HSMx-A2xx-02Feb2012
LD4 = MCD-00322: LED, Red, 0603; Part_Type: Display; Manufacturer_Part_Number: 19-217/R6C-AL1M2VY/3T; Manufacturer: EVERLIGHT; ECCN_US: EAR99; ECCN_EU: NEC; Provided_By: SUBCO; Internal_Part_Number: MCD-00322; Status: Released; Package: LED 0603; ComponentLink1Description: Datasheet; ComponentLink1URL: http://tunmcdsvn.tun.st.com/Component_Datasheet_Library/Trunk/Display/Everlight_SMD-LED-RED_19-213-R6C-AP1Q2B-3T-V3.doc
Q1 = MCD-00073: NPN Bipolar Transistor; Part_Type: IC; Manufacturer_Part_Number: BSR14; Manufacturer: ON SEMICONDUCTOR; Alternate_Manufacturer_Part_Number: MMBT2222LT1G / MMBT2222ALT1G / MMBT2222ALT3G; ECCN_US: EAR99; ECCN_EU: NEC; Provided_By: SUBCO; Revision: *; Internal_Part_Number: MCD-00073; Status: Released; ComponentLink1Description: Datasheet; ComponentLink1URL: http://tunmcdsvn.tun.st.com/Component_Datasheet_Library/Trunk/IC/NXP_Transistor_BSR14; Alternate_Manufacturer: ON SEMICONDUCTOR; Package: SOT23
R1 = MCD-00068: Resistor,1K5,0402,1%,1/16W; Manufacturer_Part_Number: RC0402FR-071K5L; Manufacturer: YAGEO; Provided_By: SUBCO; ECCN_US: EAR99; ECCN_EU: NEC; Internal_Part_Number: MCD-00068; Status: Released; Part_Type: Resistor; Package: R0402; ComponentLink1Description: Datasheet; ComponentLink1URL: http://tunmcdsvn.tun.st.com/Component_Datasheet_Library/Trunk/Resistors/Yageo_Resistor_RC0402-series
R2 R14 = MCD-00059: Resistor,100K,0402,1%,1/16W; Manufacturer_Part_Number: RC0402FR-07100KL; Manufacturer: YAGEO; Alternate_Manufacturer_Part_Number: RT0402FRE07100KL; Provided_By: SUBCO; ECCN_US: EAR99; ECCN_EU: NEC; Internal_Part_Number: MCD-00059; Status: Released; Part_Type: Resistor; Alternate_Manufacturer: YAGEO; Package: R0402; ComponentLink1Description: Datasheet; ComponentLink1URL: http://tunmcdsvn.tun.st.com/Component_Datasheet_Library/Trunk/Resistors/Yageo_Resistor_RC0402-series
R3 = MCD-00061: as R23 on sheet Power; Internal_Part_Number: MCD-00061; Status: Released; Part_Type: Resistor; Package: R0402; ComponentLink1Description: Datasheet; ComponentLink1URL: http://tunmcdsvn.tun.st.com/Component_Datasheet_Library/Trunk/Resistors/Yageo_Resistor_RC0402-series
R4 = MCD-00069: Resistor,36K,0402,1%,1/16W; Manufacturer_Part_Number: RC0402FR-0736KL; Manufacturer: YAGEO; Provided_By: SUBCO; ECCN_US: EAR99; ECCN_EU: NEC; Internal_Part_Number: MCD-00069; Status: Released; Part_Type: Resistor; Package: R0402; ComponentLink1Description: Datasheet; ComponentLink1URL: http://tunmcdsvn.tun.st.com/Component_Datasheet_Library/Trunk/Resistors/Yageo_Resistor_RC0402-series
R5 R12 R13 R16 = MCD-00053: Resistor,10K,0402,1%,1/16W; Manufacturer_Part_Number: RC0402FR-0710KL; Manufacturer: YAGEO; Provided_By: SUBCO; ECCN_US: EAR99; ECCN_EU: NEC; Internal_Part_Number: MCD-00053; Status: Released; Part_Type: Resistor; Package: R0402; ComponentLink1Description: Datasheet; ComponentLink1URL: http://tunmcdsvn.tun.st.com/Component_Datasheet_Library/Trunk/Resistors/Yageo_Resistor_RC0402-series
R6 R7 R19 = MCD-00067: Resistor,100R,0402,1%,1/16W; Manufacturer_Part_Number: RC0402FR-07100RL; Manufacturer: YAGEO; Provided_By: SUBCO; ECCN_US: EAR99; ECCN_EU: NEC; Internal_Part_Number: MCD-00067; Status: Released; Part_Type: Resistor; Package: R0402; ComponentLink1Description: Datasheet; ComponentLink1URL: http://tunmcdsvn.tun.st.com/Component_Datasheet_Library/Trunk/Resistors/Yageo_Resistor_RC0402-series
R8 = MCD-00055: Resistor,2K7,0402,1%,1/16W; Manufacturer_Part_Number: RC0402FR-072K7L; Manufacturer: YAGEO; Provided_By: SUBCO; ECCN_US: EAR99; ECCN_EU: NEC; Internal_Part_Number: MCD-00055; Status: Released; Part_Type: Resistor; Package: R0402; ComponentLink1Description: Datasheet; ComponentLink1URL: http://tunmcdsvn.tun.st.com/Component_Datasheet_Library/Trunk/Resistors/Yageo_Resistor_RC0402-series
R9-R11 = MCD-00065: Resistor,4K7,0402,1%,1/16W; Manufacturer_Part_Number: RC0402FR-074K7L; Manufacturer: YAGEO; Alternate_Manufacturer_Part_Number: RT0402FRE074K7L; Provided_By: SUBCO; ECCN_US: EAR99; ECCN_EU: NEC; Internal_Part_Number: MCD-00065; Status: Released; Part_Type: Resistor; Alternate_Manufacturer: YAGEO; Package: R0402; ComponentLink1Description: Datasheet; ComponentLink1URL: http://tunmcdsvn.tun.st.com/Component_Datasheet_Library/Trunk/Resistors/Yageo_Resistor_RC0402-series
R17 R18 = MCD-00062: Resistor,330R,0402,1%,1/16W; Manufacturer_Part_Number: RC0402FR-07330RL; Manufacturer: YAGEO; Provided_By: SUBCO; ECCN_US: EAR99; ECCN_EU: NEC; Internal_Part_Number: MCD-00062; Status: Released; Part_Type: Resistor; Package: R0402; ComponentLink1Description: Datasheet; ComponentLink1URL: http://tunmcdsvn.tun.st.com/Component_Datasheet_Library/Trunk/Resistors/Yageo_Resistor_RC0402-series
SB1 SB2 = MCD-00072: Solder Bridge OFF; Part_Type: Mechanical; Manufacturer_Part_Number: RC0603JR-070RL; Manufacturer: YAGEO; Provided_By: SUBCO; Internal_Part_Number: MCD-00072; Status: Released; ECCN_US: n/a; ECCN_EU: n/a; Package: SB0603; ComponentLink1Description: Datasheet; ComponentLink1URL: http://tunmcdsvn.tun.st.com/Component_Datasheet_Library/Trunk/Resistors/Yageo_Resistor_RC0603-series
SB3 SB4 = MCD-00071: as SB11 on sheet Power; Internal_Part_Number: MCD-00071; ECCN_US: n/a; ECCN_EU: n/a; Status: Released; Package: SB0603; ComponentLink1Description: Datasheet; ComponentLink1URL: http://tunmcdsvn.tun.st.com/Component_Datasheet_Library/Trunk/Resistors/Yageo_Resistor_RC0603-series
U5 = MCD-00083: Enhanced single channel power switches with active low enable pin; Part_Type: IC; Manufacturer: STMICROELECTRONICS; Alternate_Manufacturer_Part_Number: TPS2041C; Alternate_Manufacturer: TEXAS INSTRUMENTS; BMS_Part_Number: 9159003; ECCN_US: EAR99; ECCN_EU: NEC; Provided_By: SUBCO with ST control; Internal_Part_Number: MCD-00083; Value: STMPS2141STR; Status: Released; Manufacturer_Part_Number: STMPS2141STR; ComponentLink1Description: Datasheet; ComponentLink1URL: http://tunmcdsvn.tun.st.com/Component_Datasheet_Library/Trunk/IC/STM_PWR-Switch_STMPS2141STR
U6 = MCD-00169: USB OTG FS ESD protection; Part_Type: IC; Manufacturer: STMICROELECTRONICS; BMS_Part_Number: 9151057; ECCN_US: EAR99; ECCN_EU: NEC; Provided_By: SUBCO with ST control; Internal_Part_Number: MCD-00169; Value: USBLC6-2P6; Status: Released; Manufacturer_Part_Number: USBLC6-2P6; ComponentLink1Description: Datasheet; ComponentLink1URL: http://tunmcdsvn.tun.st.com/Component_Datasheet_Library/Trunk/Diodes/STM_ESD_USBLC6-2
U7 = MCD-00085: Medium-density performance line ARM-based 32-bit MCU with 128KB Flash; Manufacturer: STMICROELECTRONICS; Part_Type: IC; BMS_Part_Number: 9175111; ECCN_US: 3A991A2; ECCN_EU: NEC; Provided_By: SUBCO with ST control; Value: STM32F103CBT6; Internal_Part_Number: MCD-00085; Manufacturer_Part_Number: STM32F103CBT6; ComponentLink1Description: Datasheet; Status: Released; ComponentLink1URL: http://tunmcdsvn.tun.st.com/Component_Datasheet_Library/Trunk/IC/STM_STM32F103CBT6
X2 = MCD-00092: Crystal 8MHz, 8pF, +-20ppm, 500ohms max,  SMD; Part_Type: Crystal_Osc; Manufacturer_Part_Number: NX3225GD 8MHz EXS00A-CG04874; Manufacturer: NDK; BMS_Part_Number: 9157029; ECCN_US: EAR99; ECCN_EU: NEC; Provided_By: SUBCO; Internal_Part_Number: MCD-00092; Status: Released; ComponentLink1Description: Datasheet; ComponentLink1URL: http://tunmcdsvn.tun.st.com/Component_Datasheet_Library/Trunk/Crystal_Osc/NDK_Crystal-For-ST_NX3225GD 8MHz EXS00A-CG04874 (EXS10B-20725); Order_Code_Digikey: 644-1391

## Sheet STM32G0_microcontroller.SchDoc: STM32G0 microcontroller
size A4; Date: Not used; ApprovedBy: Not used; CheckedBy: Not used; Author: Not used; CompanyName: STMicroelectronics; DrawnBy: Not used; Engineer: Not used; Organization: Not used; Address1: Not used; Address2: Not used; Address3: Not used; Address4: Not used; DocumentNumber: Not used; Revision: Not used; SheetNumber: 3; SheetTotal: 6; CurrentTime: Not used; CurrentDate: Not used; Time: Not used; DocumentFullPathAndName: Not used; DocumentName: Not used; ModifiedDate: Not used; ImagePath: Not used; ProjectName: Not used; Application_BuildNumber: Not used
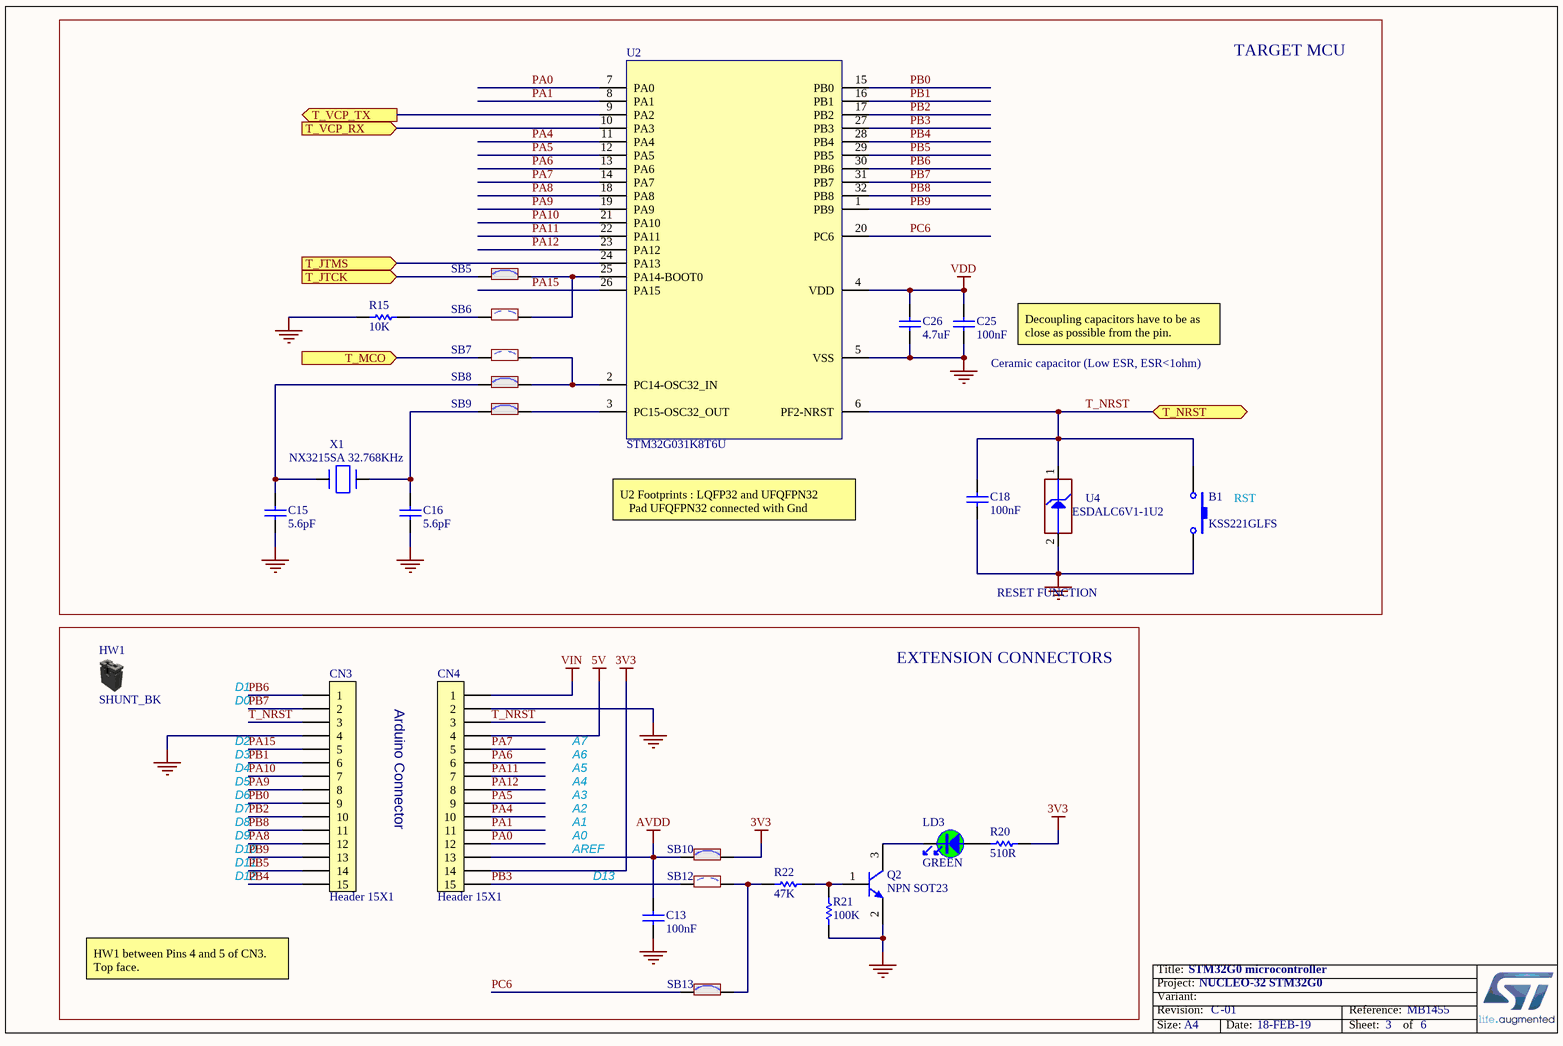
[diagram p5: STM32G0_microcontroller.SchDoc]

### Parts
B1  value KSS221GLFS  [SWI_C&K_ITT_KSS221G]  (hidden comment: SW-PB)
C13  value 100nF  [C0402]  (hidden comment: Capacitor)
C15  value 5.6pF  [C0402]  (hidden comment: Capacitor)
C16  value 5.6pF  [C0402]  (hidden comment: Capacitor)
C18  value 100nF  [C0402]  (hidden comment: Capacitor)
C25  value 100nF  [C0402]  (hidden comment: Capacitor)
C26  value 4.7uF  [C0402]  (hidden comment: Capacitor)
CN3  Header 15x1  [CON_LYCN_313115S161145]
CN4  Header 15x1  [CON_LYCN_313115S161145]
HW1  value SHUNT_BK  (hidden comment: Shunt Black 2.54mm)  (mechanical)
LD3  value GREEN  [LED_0603_GREEN]  (hidden comment: LED_green)
Q2  value NPN SOT23  [NPN_SOT23]  (hidden comment: 9013-SOT23)
R15  value 10K  [R0402]  (hidden comment: Resistor)
R20  value 510R  [R0402]  (hidden comment: Resistor)
R21  value 100K  [R0402]  (hidden comment: Resistor)
R22  value 47K  [R0402]  (hidden comment: Resistor)
SB5  SB_ON  [SOLDER-BRIDGE_R0603-0R]  (value not drawn)
SB6  SB_OFF  [SOLDER-BRIDGE_R0603-0R]  (value not drawn)
SB7  SB_OFF  [SOLDER-BRIDGE_R0603-0R]  (value not drawn)
SB8  SB_ON  [SOLDER-BRIDGE_R0603-0R]  (value not drawn)
SB9  SB_ON  [SOLDER-BRIDGE_R0603-0R]  (value not drawn)
SB10  SB_ON  [SOLDER-BRIDGE_R0603-0R]  (value not drawn)
SB12  SB_OFF  [SOLDER-BRIDGE_R0603-0R]  (value not drawn)
SB13  SB_ON  [SOLDER-BRIDGE_R0603-0R]  (value not drawn)
U2  STM32G031K8T6U  [ICC_LQFP32_7X7_P080__UFQFPN32-EPAD_5X5_P050__DI]
U4  value ESDALC6V1-1U2  [ESD_ST0201]  (hidden comment: ESD-TRANSIL)
X1  value NX3215SA 32.768KHz  [CRY_NX3215SA_2P]  (hidden comment: XTAL_2_PINS)

### Blocks framed on the sheet
TARGET MCU: B1 C15 C16 C18 C25 C26 R15 SB5-SB9 U2 U4 X1
EXTENSION CONNECTORS: C13 CN3 CN4 HW1 LD3 Q2 R20-R22 SB10 SB12 SB13

### Ports
T_JTCK (in), T_JTMS (in), T_MCO (in), T_NRST (bidir), T_VCP_RX (in), T_VCP_TX (out)

### Nets
3V3: CN4.14 R20.2 SB10.2
5V: CN4.4
AVDD: C13.2 CN4.13 SB10.1
GND: B1.2 C13.1 C15.1 C16.1 C18.1 C25.1 C26.1 CN3.4 CN4.2 Q2.2(E) R15.1 R21.1 U2.5(VSS) U4.2(GND)
VDD: C25.2 C26.2 U2.4(VDD)
VIN: CN4.1
PA0: CN4.12 U2.7(PA0)
PA1: CN4.11 U2.8(PA1)
PA4: CN4.10 U2.11(PA4)
PA5: CN4.9 U2.12(PA5)
PA6: CN4.6 U2.13(PA6)
PA7: CN4.5 U2.14(PA7)
PA8: CN3.12 U2.18(PA8)
PA9: CN3.8 U2.19(PA9)
PA10: CN3.7 U2.21(PA10)
PA11: CN4.7 U2.22(PA11)
PA12: CN4.8 U2.23(PA12)
PA15: CN3.5 U2.26(PA15)
PB0: CN3.9 U2.15(PB0)
PB1: CN3.6 U2.16(PB1)
PB2: CN3.10 U2.17(PB2)
PB3: CN4.15 SB12.1 U2.27(PB3)
PB4: CN3.15 U2.28(PB4)
PB5: CN3.14 U2.29(PB5)
PB6: CN3.1 U2.30(PB6)
PB7: CN3.2 U2.31(PB7)
PB8: CN3.11 U2.32(PB8)
PB9: CN3.13 U2.1(PB9)
PC6: SB13.1 U2.20(PC6)
T_JTCK: SB5.1 ; port T_JTCK
T_JTMS: U2.24(PA13) ; port T_JTMS
T_NRST: B1.1 C18.2 CN3.3 CN4.3 U2.6(PF2-NRST) U4.1(IO1) ; port T_NRST
NetC3_2: SB7.1 ; port T_MCO
NetC15_2: C15.2 SB8.1 X1.1(X1)
NetC16_2: C16.2 SB9.1 X1.2(X2)
NetLD3_1: LD3.1 R20.1
NetLD3_2: LD3.2 Q2.3(C)
NetQ2_1: Q2.1(B) R21.2 R22.2
NetR15_2: R15.2 SB6.1
NetR22_1: R22.1 SB12.2 SB13.2
NetSB3_1: U2.9(PA2) ; port T_VCP_TX
NetSB4_1: U2.10(PA3) ; port T_VCP_RX
NetSB5_2: SB5.2 SB6.2 U2.25(PA14-BOOT0)
NetSB7_2: SB7.2 SB8.2 U2.2(PC14-OSC32_IN)
NetSB9_2: SB9.2 U2.3(PC15-OSC32_OUT)

### Notes on the sheet
- (near C25) Ceramic capacitor (Low ESR, ESR<1ohm)
- Decoupling capacitors have to be as close as possible from the pin.
- U2 Footprints : LQFP32 and UFQFPN32
  Pad UFQFPN32 connected with Gnd
- (near B1) RST
- RESET FUNCTION
- D0
- D1
- Arduino Connector
- D2
- D4
- D3
- D5
- A4
- A5
- A6
- A7
- D6
- D7
- D8
- D9
- D10
- A0
- A1
- A2
- A3
- AREF
- D12
- D11
- D13
- HW1 between Pins 4 and 5 of CN3. Top face.
- Title:
- Project:
- Size:
- Revision:
- Variant:
- -
- Date:
- Reference:
- Sheet:
- of

### Library data of the parts
B1 = MCD-01335: Subminiature Side Actuated Tact Switch for SMT - KSS series - 2.0 Newtons - Gull wing, SPST; Part_Type: Misc; Manufacturer: C&K; Provided_By: SUBCO; ECCN_US: EAR99; ECCN_EU: NEC; Internal_Part_Number: MCD-01335; Status: Checked; Manufacturer_Part_Number: KSS221GLFS; ComponentLink1Description: Datasheet; ComponentLink1URL: http://tunmcdsvn.tun.st.com/Component_Datasheet_Library/Trunk/Misc/C&K_switch_button_KSS221GLFS/C&K_SWITCH_KSS221GLFS.pdf
C13 C18 C25 = MCD-00102: as C7 on sheet Power; Internal_Part_Number: MCD-00102; Status: Released; Package: C0402; ComponentLink1Description: Datasheet; Part_Type: Capacitor; ComponentLink1URL: http://tunmcdsvn.tun.st.com/Component_Datasheet_Library/Trunk/Capacitors/Yageo_Multilayer_Capacitor_X7R_series_100pF_to_22uF
C15 C16 = MCD-01374: Capacitor, MLCC, 5.6pF, 50V, NPO, +/- 0.1pF, 0402, T=0,5mm; Manufacturer_Part_Number: CC0402BRNPO9BN5R6; Manufacturer: YAGEO; Provided_By: SUBCO; Internal_Part_Number: MCD-01374; Status: Released; Part_Type: Capacitor; Package: C0402; ComponentLink1Description: Datasheet; ComponentLink1URL: http://tunmcdsvn.tun.st.com/Component_Datasheet_Library/Trunk/Capacitors/Yageo_Capacitor_NP0_16V-to-50V; ECCN_US: N/A; ECCN_EU: N/A
C26 = MCD-00096: Capacitor, MLCC, 4.7uF, 6V3, X5R, 20%, 0402, T=0,5mm; Manufacturer_Part_Number: GRM155R60J475ME87; Manufacturer: MURATA; Provided_By: SUBCO; ECCN_US: EAR99; ECCN_EU: NEC; Internal_Part_Number: MCD-00096; Status: Obsolete; Part_Type: Capacitor; Package: C0402; ComponentLink1Description: Datasheet; ComponentLink1URL: http://tunmcdsvn.tun.st.com/Component_Datasheet_Library/Trunk/Capacitors/Murata_Capacitor_GR_series
CN3 CN4 = MCD-01332: Pin header, 15x1, 2,54mm, VR, TH, Height 6mm/6mm; Part_Type: Connector; Manufacturer_Part_Number: 313115S161145; Manufacturer: LYCONN; Alternate_Manufacturer_Part_Number: TSW 115-08-F-S; Alternate_Manufacturer: SAMTEC; Provided_By: SUBCO; Internal_Part_Number: MCD-01332; Value: Header 15X1; Status: Footprint available; ComponentLink1Description: Datasheet; ComponentLink1URL: http://tunmcdsvn.tun.st.com/Component_Datasheet_Library/Trunk/Connectors/LYCN_3131xxS141; ECCN_US: n/a; ECCN_EU: n/a
HW1 = MCD-00122: SHUNT, 2.54mm, height 6.10mm, BLACK; Part_Type: Misc; Manufacturer_Part_Number: SNT-100-BK-G; Manufacturer: SAMTEC; Alternate_Manufacturer_Part_Number: MJ-6B2.0*3.5; Alternate_Manufacturer: LIANYI; Provided_By: SUBCO; ECCN_US: EAR99; ECCN_EU: NEC; Internal_Part_Number: MCD-00122; Status: Released; ComponentLink1Description: Datasheet; ComponentLink1URL: http://tunmcdsvn.tun.st.com/Component_Datasheet_Library/Trunk/Connectors/Samtec_Shunt_Jumper_SNT100
LD3 = MCD-00050: LED, Green, 0603; Manufacturer_Part_Number: 19-213SYGC/S530-E2/TR8; Manufacturer: EVERLIGHT; Part_Type: Display; Provided_By: SUBCO; ECCN_US: EAR99; ECCN_EU: NEC; Internal_Part_Number: MCD-00050; ComponentLink1Description: Datasheet; Status: Released; ComponentLink1URL: http://tunmcdsvn.tun.st.com/Component_Datasheet_Library/Trunk/Display/Everlight_SMD-LED-GREEN_19-213SYGC-S530-XX-TR8-v3.doc; Package: LED 0603
Q2 = MCD-00073: NPN Bipolar Transistor; Part_Type: IC; Manufacturer_Part_Number: BSR14; Manufacturer: ON SEMICONDUCTOR; Alternate_Manufacturer_Part_Number: MMBT2222LT1G / MMBT2222ALT1G / MMBT2222ALT3G; Provided_By: SUBCO; ECCN_US: EAR99; ECCN_EU: NEC; Revision: *; Internal_Part_Number: MCD-00073; Status: Released; ComponentLink1Description: Datasheet; ComponentLink1URL: http://tunmcdsvn.tun.st.com/Component_Datasheet_Library/Trunk/IC/NXP_Transistor_BSR14; Alternate_Manufacturer: ON SEMICONDUCTOR; Package: SOT23
R15 = MCD-00053: as R5 on sheet ST_LINK_V2-1; Internal_Part_Number: MCD-00053; Status: Released; Part_Type: Resistor; Package: R0402; ComponentLink1Description: Datasheet; ComponentLink1URL: http://tunmcdsvn.tun.st.com/Component_Datasheet_Library/Trunk/Resistors/Yageo_Resistor_RC0402-series
R20 = MCD-00064: Resistor,510R,0402,1%,1/16W; Manufacturer_Part_Number: RC0402FR-07510RL; Manufacturer: YAGEO; Provided_By: SUBCO; ECCN_US: EAR99; ECCN_EU: NEC; Internal_Part_Number: MCD-00064; Status: Released; Part_Type: Resistor; Package: R0402; ComponentLink1Description: Datasheet; ComponentLink1URL: http://tunmcdsvn.tun.st.com/Component_Datasheet_Library/Trunk/Resistors/Yageo_Resistor_RC0402-series
R21 = MCD-00059: as R2 on sheet ST_LINK_V2-1; Internal_Part_Number: MCD-00059; Status: Released; Part_Type: Resistor; Alternate_Manufacturer: YAGEO; Package: R0402; ComponentLink1Description: Datasheet; ComponentLink1URL: http://tunmcdsvn.tun.st.com/Component_Datasheet_Library/Trunk/Resistors/Yageo_Resistor_RC0402-series
R22 = MCD-00063: Resistor,47K,0402,1%,1/16W; Manufacturer_Part_Number: RC0402FR-0747KL; Manufacturer: YAGEO; Provided_By: SUBCO; ECCN_US: EAR99; ECCN_EU: NEC; Internal_Part_Number: MCD-00063; Status: Released; Part_Type: Resistor; Package: R0402; ComponentLink1Description: Datasheet; ComponentLink1URL: http://tunmcdsvn.tun.st.com/Component_Datasheet_Library/Trunk/Resistors/Yageo_Resistor_RC0402-series
SB5 SB8-SB10 SB13 = MCD-00071: as SB11 on sheet Power; Internal_Part_Number: MCD-00071; Status: Released; ComponentLink1Description: Datasheet; Package: SB0603; ComponentLink1URL: http://tunmcdsvn.tun.st.com/Component_Datasheet_Library/Trunk/Resistors/Yageo_Resistor_RC0603-series; ECCN_US: n/a; ECCN_EU: n/a
SB6 SB7 SB12 = MCD-00072: as SB1 on sheet ST_LINK_V2-1; Internal_Part_Number: MCD-00072; Status: Released; Package: SB0603; ComponentLink1Description: Datasheet; ComponentLink1URL: http://tunmcdsvn.tun.st.com/Component_Datasheet_Library/Trunk/Resistors/Yageo_Resistor_RC0603-series; ECCN_US: n/a; ECCN_EU: n/a
U2 = MCD-01738: Mainstream Arm Cortex-M0+ MCU with 64 Kbytes of of Flash memory memory, 8 Kbytes RAM, 64 MHz CPU, 2x USART, timers, ADC, comm. I/F, 1.65-3.6V; Manufacturer: STMICROELECTRONICS; Part_Type: IC; Provided_By: SUBCO with ST control; ECCN_US: 3A991A2; ECCN_EU: NEC; Manufacturer_Part_Number: STM32G031K8T6U; Package: LQFP32; Internal_Part_Number: MCD-01738; Value: STM32G031K8T6U; Status: Checked; ComponentLink1Description: Datasheet
U4 = MCD-00170: ESD protection 6V1; Part_Type: Diode; Manufacturer: STMICROELECTRONICS; BMS_Part_Number: 9151132; Provided_By: SUBCO with ST control; ECCN_US: EAR99; ECCN_EU: NEC; Internal_Part_Number: MCD-00170; Status: Released; Manufacturer_Part_Number: ESDALC6V1-1U2; ComponentLink1Description: Datasheet; ComponentLink1URL: http://tunmcdsvn.tun.st.com/Component_Datasheet_Library/Trunk/Diodes/STM_ESD_ESDALC6V1-1U2
X1 = MCD-00091: Crystal 32.768kHz, 6pF, +-20ppm, 50Kohms max, SMD; Part_Type: Crystal_Osc; Manufacturer_Part_Number: NX3215SA 32.768KHz EXS00A-MU00525; Manufacturer: NDK; BMS_Part_Number: 9157034; ECCN_US: EAR99; ECCN_EU: NEC; Provided_By: SUBCO; Internal_Part_Number: MCD-00091; Status: Released; ComponentLink1Description: Datasheet; ComponentLink1URL: http://tunmcdsvn.tun.st.com/Component_Datasheet_Library/Trunk/Crystal_Osc/NDK_Crystal-For-ST_NX3215SA 32.768KHz EXS00A-MU00525 (EXS10B-21238); Order_Code_Digikey: 644-1386

## Nets that join several sheets
3V3: Power (JP1.1 SB11.2), ST_LINK_V2-1 (R11.1), STM32G0_microcontroller (CN4.14 R20.2 SB10.2)
3V3_STLK: Power (C7.2 C9.2 U1.5), ST_LINK_V2-1 (13 pins)
5V: Power (7 pins), STM32G0_microcontroller (CN4.4)
5V_USB_CHGR: Power (D3.1), ST_LINK_V2-1 (7 pins)
5V_USB_STLK: Power (D2.1), ST_LINK_V2-1 (C21.2 U5.1)
E5V: Power (5 pins), ST_LINK_V2-1 (D1.1)
GND: Power (16 pins), ST_LINK_V2-1 (34 pins), STM32G0_microcontroller (14 pins)
VDD: Power (JP1.2), STM32G0_microcontroller (C25.2 C26.2 U2.4)
VIN: Power (C24.2 U8.3), STM32G0_microcontroller (CN4.1)
NetC3_2: ST_LINK_V2-1 (C3.2 R7.2), STM32G0_microcontroller (SB7.1)
NetSB3_1: ST_LINK_V2-1 (SB3.1), STM32G0_microcontroller (U2.9)
NetSB4_1: ST_LINK_V2-1 (SB4.1), STM32G0_microcontroller (U2.10)
T_JTCK: ST_LINK_V2-1 (U7.15 U7.26), STM32G0_microcontroller (SB5.1)
T_JTMS: ST_LINK_V2-1 (R19.2 U7.27), STM32G0_microcontroller (U2.24)
T_NRST: ST_LINK_V2-1 (U7.18), STM32G0_microcontroller (6 pins)

## Assembly variants
G031K8: not fitted C3 C14 CN2 CN3 JP1 R7 SB1 SB2 SB6 SB7 SB12